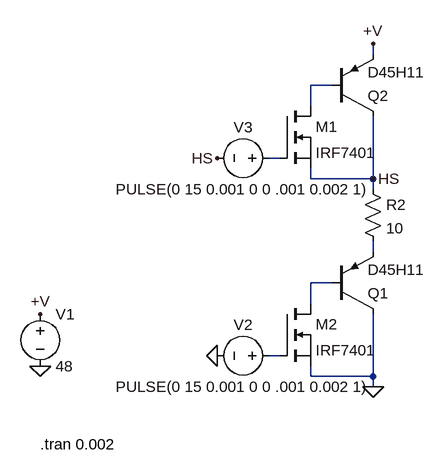
[diagram p0: schematic igbt.asc]
igbt.asc, the LTspice schematic file:
Version 4
SHEET 1 880 680
WIRE 480 -320 480 -336
WIRE 416 -272 384 -272
WIRE 384 -240 384 -272
WIRE 336 -160 320 -160
WIRE 384 -128 384 -144
WIRE 480 -128 480 -224
WIRE 480 -128 384 -128
WIRE 480 -112 480 -128
WIRE 480 -16 480 -32
WIRE 416 32 384 32
WIRE 384 64 384 32
WIRE 336 144 320 144
WIRE 384 176 384 160
WIRE 480 176 480 80
WIRE 480 176 384 176
WIRE 480 192 480 176
FLAG -32 80 +V
FLAG -32 160 0
FLAG 480 192 0
FLAG 240 144 0
FLAG 480 -336 +V
FLAG 480 -128 HS
FLAG 240 -160 HS
SYMBOL voltage -32 64 R0
SYMATTR InstName V1
SYMATTR Value 48
SYMBOL voltage 336 144 R90
WINDOW 0 -32 56 VBottom 2
WINDOW 3 32 56 VTop 2
SYMATTR InstName V2
SYMATTR Value PULSE(0 15 0.001 0 0 .001 0.002 1)
SYMBOL pnp 416 -224 M180
SYMATTR InstName Q2
SYMATTR Value D45H11
SYMBOL res 464 -128 R0
SYMATTR InstName R2
SYMATTR Value 10
SYMBOL voltage 336 -160 R90
WINDOW 0 -32 56 VBottom 2
WINDOW 3 32 56 VTop 2
SYMATTR InstName V3
SYMATTR Value PULSE(0 15 0.001 0 0 .001 0.002 1)
SYMBOL nmos 336 -240 R0
SYMATTR InstName M1
SYMATTR Value IRF7401
SYMBOL nmos 336 64 R0
SYMATTR InstName M2
SYMATTR Value IRF7401
SYMBOL pnp 416 80 M180
SYMATTR InstName Q1
SYMATTR Value D45H11
TEXT -32 280 Left 2 !.tran 0.002

The netlist it stands for:
* igbt.asc
V1 +V 0 48
V2 N005 0 PULSE(0 15 0.001 0 0 .001 0.002 1)
Q2 HS N001 +V 0 D45H11
R2 HS N003 10
V3 N002 HS PULSE(0 15 0.001 0 0 .001 0.002 1)
M1 N001 N002 HS HS IRF7401
M2 N004 N005 0 0 IRF7401
Q1 0 N004 N003 0 D45H11
.model NPN NPN
.model PNP PNP
.lib standard.bjt
.model NMOS NMOS
.model PMOS PMOS
.lib standard.mos
.tran 0.002
.backanno
.end